# EAGLE schematic Poppy_IO_Core_v1.1 (EAGLE 7.3.0)
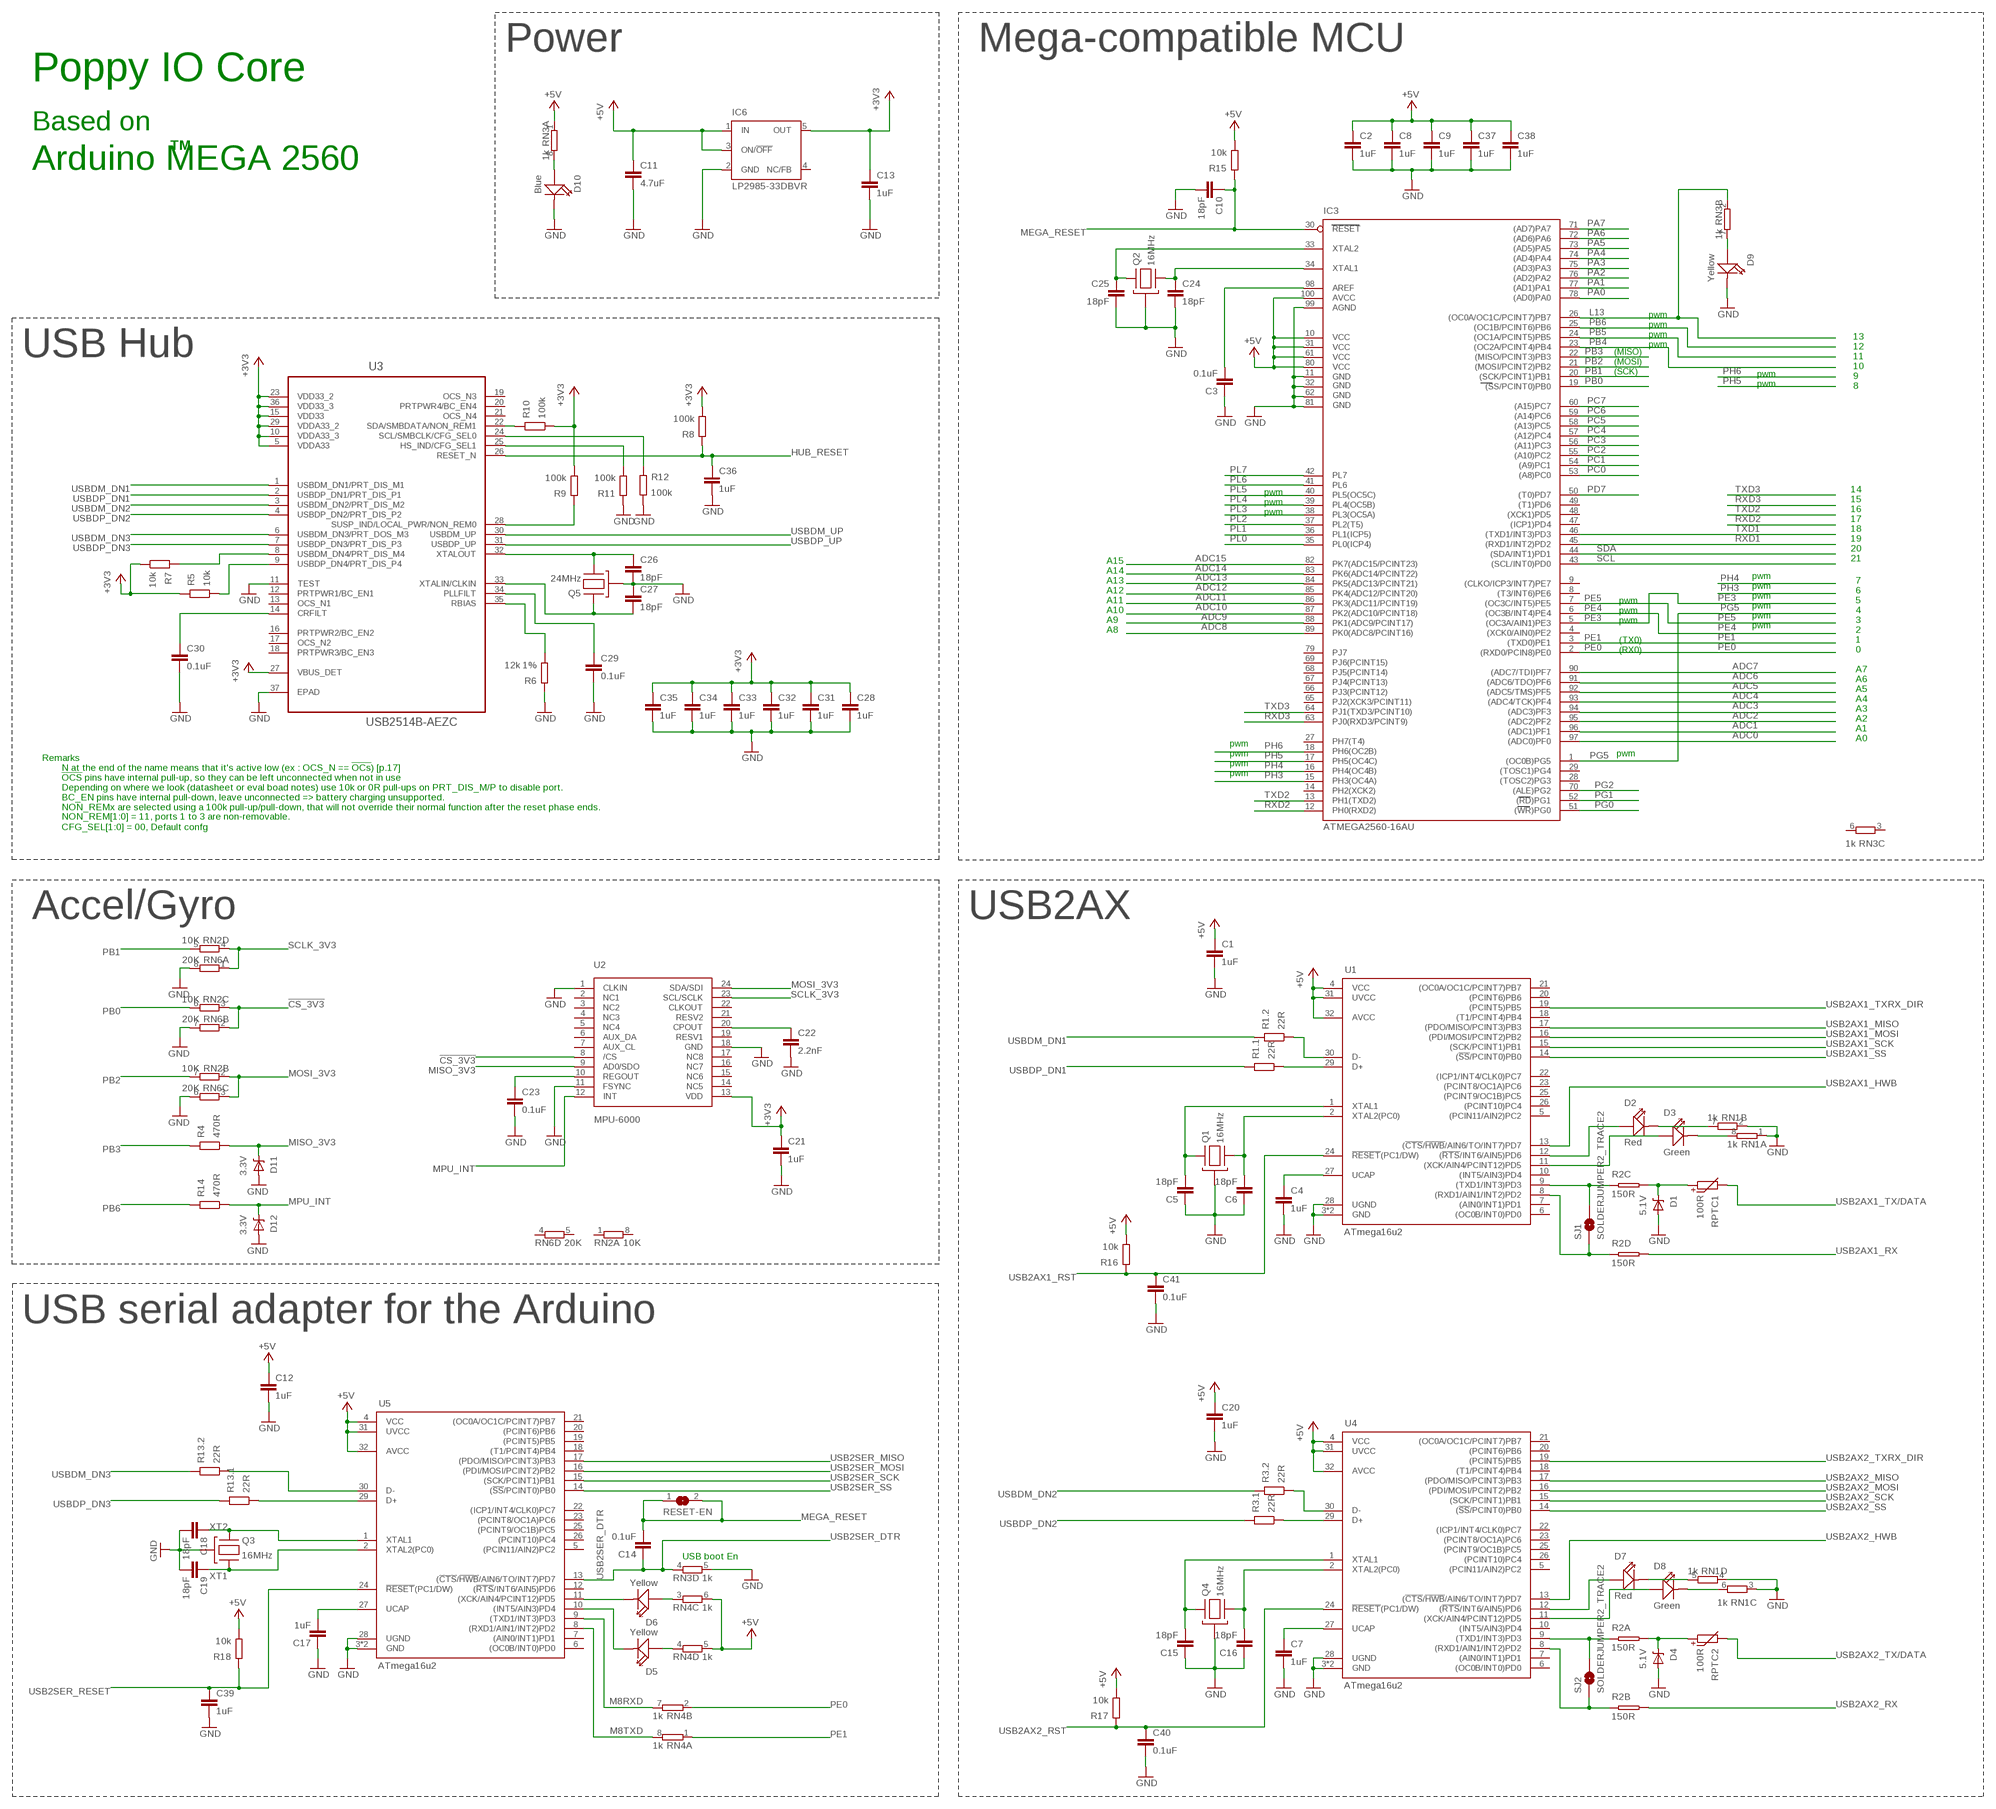
[diagram p0: schematic, sheet 1, part 1 of 2]
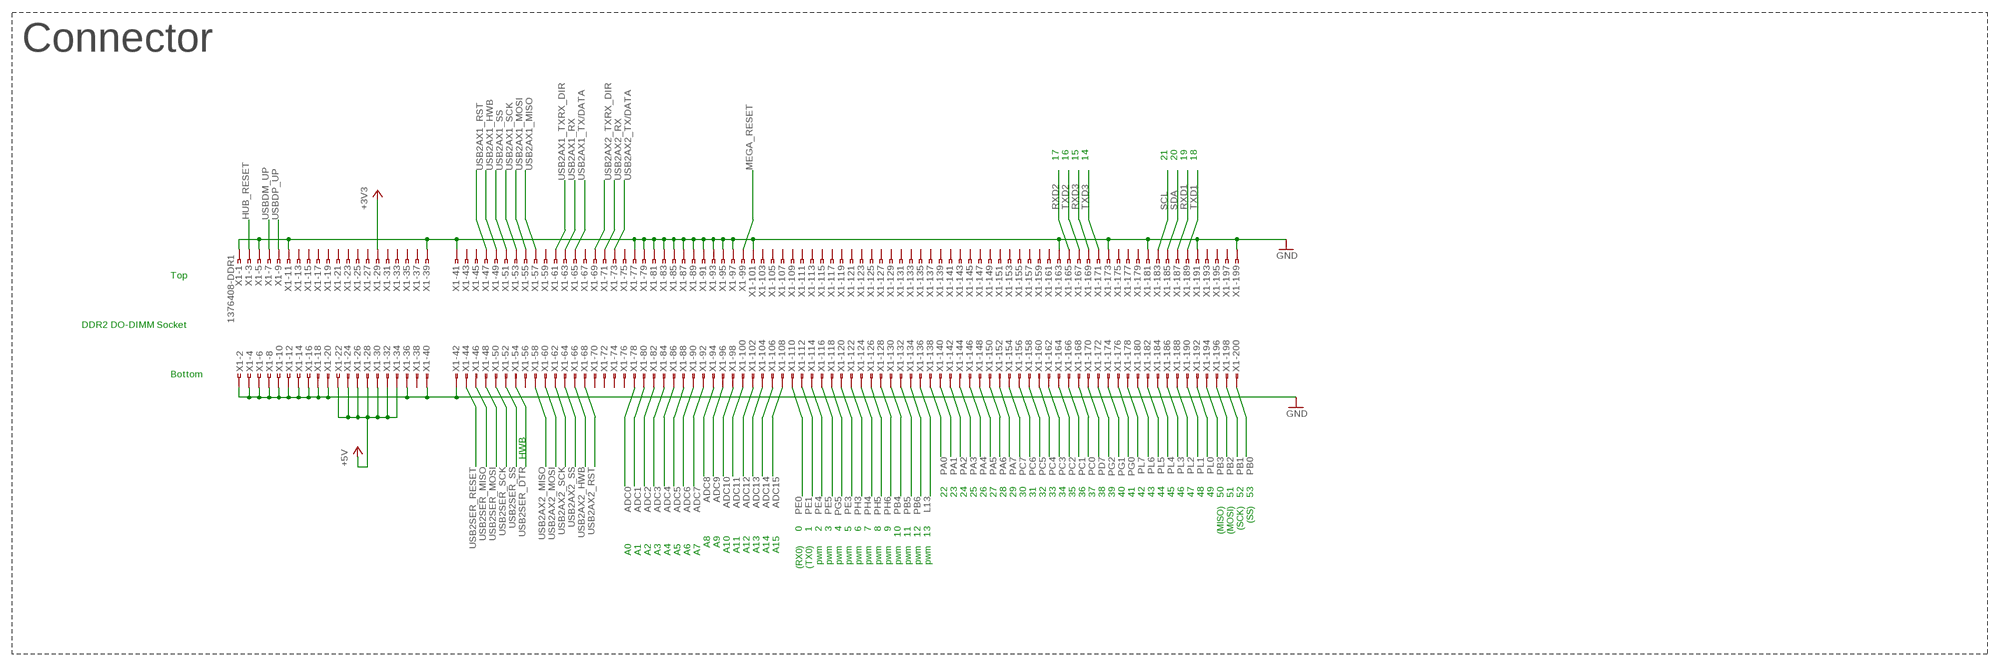
[diagram p1: schematic, sheet 1, part 2 of 2]

## Parts
C1  1uF  C0402  [0402_N]
C2  1uF  C0402  [0402_N]
C3  0.1uF  C0402  [0402_N]
C4  1uF  C0402  [0402_N]
C5  18pF  C0402  [0402_N]
C6  18pF  C0402  [0402_N]
C7  1uF  C0402  [0402_N]
C8  1uF  C0402  [0402_N]
C9  1uF  C0402  [0402_N]
C10  18pF  C0402  [0402_N]
C11  4.7uF  C0805  [0805_N]
C12  1uF  C0402  [0402_N]
C13  1uF  C0402  [0402_N]
C14  0.1uF  C0402  [0402_N]
C15  18pF  C0402  [0402_N]
C16  18pF  C0402  [0402_N]
C17  1uF  C0402  [0402_N]
C18  18pF  C0402  [0402_N]
C19  18pF  C0402  [0402_N]
C20  1uF  C0402  [0402_N]
C21  1uF  C0402  [0402_N]
C22  2.2nF  C0402  [0402_N]
C23  0.1uF  C0402  [0402_N]
C24  18pF  C0402  [0402_N]
C25  18pF  C0402  [0402_N]
C26  18pF  C0402  [0402_N]
C27  18pF  C0402  [0402_N]
C28  1uF  C0402  [0402_N]
C29  0.1uF  C0402  [0402_N]
C30  0.1uF  C0402  [0402_N]
C31  1uF  C0402  [0402_N]
C32  1uF  C0402  [0402_N]
C33  1uF  C0402  [0402_N]
C34  1uF  C0402  [0402_N]
C35  1uF  C0402  [0402_N]
C36  1uF  C0402  [0402_N]
C37  1uF  C0402  [0402_N]
C38  1uF  C0402  [0402_N]
C39  1uF  C0402  [0402_N]
C40  0.1uF  C0402  [0402_N]
C41  0.1uF  C0402  [0402_N]
D1  5.1V  DIODE_ZENER-923  [SOD-923_N]
D2  Red  LED  [LED0603]
D3  Green  LED  [LED0603]
D4  5.1V  DIODE_ZENER-923  [SOD-923_N]
D5  Yellow  LED  [LED0603]
D6  Yellow  LED  [LED0603]
D7  Red  LED  [LED0603]
D8  Green  LED  [LED0603]
D9  Yellow  LED  [LED0603]
D10  Blue  LED  [LED0603]
D11  3.3V  DIODE_ZENER-SOD523  [SOD-523_N]
D12  3.3V  DIODE_ZENER-SOD523  [SOD-523_N]
IC3  ATMEGA2560-16AU  ATMEGA25602560-16AU  [TQFP100]
IC6  LP2985-33DBVR  LP2985-XXDBVR33  [SOT23-DBV]
Q1  16MHz  CRYSTAL_W/BODY_403  [CRYSTAL_MODEL-403_N]
Q2  16MHz  CRYSTAL_W/BODY_403  [CRYSTAL_MODEL-403_N]
Q3  16MHz  CRYSTAL_W/BODY_403  [CRYSTAL_MODEL-403_N]
Q4  16MHz  CRYSTAL_W/BODY_403  [CRYSTAL_MODEL-403_N]
Q5  24MHz  CRYSTAL_W/BODY_403  [CRYSTAL_MODEL-403_N]
R1  22R  R_2-0402  [ARRAY_0402_65P_2_N]
R2  150R  R-4R  [R1206-8]
R3  22R  R_2-0402  [ARRAY_0402_65P_2_N]
R4  470R  R0402  [0402_N]
R5  10k  R0402  [0402_N]
R6  12k 1%  R0402  [0402_N]
R7  10k  R0402  [0402_N]
R8  100k  R0402  [0402_N]
R9  100k  R0402  [0402_N]
R10  100k  R0402  [0402_N]
R11  100k  R0402  [0402_N]
R12  100k  R0402  [0402_N]
R13  22R  R_2-0402  [ARRAY_0402_65P_2_N]
R14  470R  R0402  [0402_N]
R15  10k  R0402  [0402_N]
R16  10k  R0402  [0402_N]
R17  10k  R0402  [0402_N]
R18  10k  R0402  [0402_N]
RESET-EN  SJ  [SJ]
RN1  1k  4R-NCAY16  [CAY16]
RN2  10K  4R-NCAT16  [CAT16]
RN3  1k  4R-NCAY16  [CAY16]
RN4  1k  4R-NCAY16  [CAY16]
RN6  20K  4R-NCAT16  [CAT16]
RPTC1  100R  R-PTC0603  [0603_N]
RPTC2  100R  R-PTC0603  [0603_N]
SJ1  SOLDERJUMPER2_TRACE2  [SJ_2S-TRACE2]
SJ2  SOLDERJUMPER2_TRACE2  [SJ_2S-TRACE2]
U1  ATmega16u2  IC_ATMEGAXXU2-MU  [QFN-32_50P_N]
U2  MPU-6000  [QFN-24]
U3  USB2514B-AEZC  [QFN50P600X600X100-37N]
U4  ATmega16u2  IC_ATMEGAXXU2-MU  [QFN-32_50P_N]
U5  ATmega16u2  IC_ATMEGAXXU2-MU  [QFN-32_50P_N]
X1  1376408-DDR1  [DDR1]

## Nets
!CS_3V3: RN2.3 RN6.2 U2.8(/CS)
+3V3: C13.1 C21.1 C28.1 C31.1 C32.1 C33.1 C34.1 C35.1 IC6.5(OUT) R5.2 R7.1 R8.1 R9.1 R10.1 U2.13(VDD) U3.5(VDDA33) U3.10(VDDA33_3) U3.15(VDD33) U3.23(VDD33_2) U3.27(VBUS_DET) U3.29(VDDA33_2) U3.36(VDD33_3) X1.29
+5V: C1.1 C2.1 C8.1 C9.1 C11.1 C12.1 C20.1 C37.1 C38.1 IC3.10(VCC) IC3.31(VCC1) IC3.61(VCC2) IC3.80(VCC3) IC3.100(AVCC) IC6.1(IN) IC6.3(ON/!OFF) R15.1 R16.1 R17.1 R18.1 RN3.1 RN4.5 RN4.6 U1.4(VCC) U1.31(UVCC) U1.32(AVCC) U4.4(VCC) U4.31(UVCC) U4.32(AVCC) U5.4(VCC) U5.31(UVCC) U5.32(AVCC) X1.22 X1.24 X1.26 X1.28 X1.30 X1.32 X1.34
ADC0: IC3.97((ADC0)PF0) X1.78
ADC1: IC3.96((ADC1)PF1) X1.80
ADC2: IC3.95((ADC2)PF2) X1.82
ADC3: IC3.94((ADC3)PF3) X1.84
ADC4: IC3.93((ADC4/TCK)PF4) X1.86
ADC5: IC3.92((ADC5/TMS)PF5) X1.88
ADC6: IC3.91((ADC6/TDO)PF6) X1.90
ADC7: IC3.90((ADC7/TDI)PF7) X1.92
ADC8: IC3.89(PK0(ADC8/PCINT16)) X1.94
ADC9: IC3.88(PK1(ADC9/PCINT17)) X1.96
ADC10: IC3.87(PK2(ADC10/PCINT18)) X1.98
ADC11: IC3.86(PK3(ADC11/PCINT19)) X1.100
ADC12: IC3.85(PK4(ADC12/PCINT20)) X1.102
ADC13: IC3.84(PK5(ADC13/PCINT21)) X1.104
ADC14: IC3.83(PK6(ADC14/PCINT22)) X1.106
ADC15: IC3.82(PK7(ADC15/PCINT23)) X1.108
AREF: C3.2 IC3.98(AREF)
GND: C1.2 C2.2 C3.1 C4.2 C5.1 C6.1 C7.2 C8.2 C9.2 C10.2 C11.2 C12.2 C13.2 C15.1 C16.1 C17.1 C18.2 C19.2 C20.2 C21.2 C22.2 C23.2 C24.2 C25.2 C26.2 C27.1 C28.2 C29.2 C30.2 C31.2 C32.2 C33.2 C34.2 C35.2 C36.2 C37.2 C38.2 C39.2 C40.2 C41.2 D1.A D4.A D9.- D10.- D11.A D12.A IC3.11(GND) IC3.32(GND1) IC3.62(GND2) IC3.81(GND3) IC3.99(AGND) IC6.2(GND) Q1.P$2(GND) Q1.P$4(GND) Q2.P$2(GND) Q2.P$4(GND) Q3.P$2(GND) Q3.P$4(GND) Q4.P$2(GND) Q4.P$4(GND) Q5.P$2(GND) Q5.P$4(GND) R6.2 R11.2 R12.1 RN1.1 RN1.2 RN1.3 RN1.4 RN3.5 RN6.6 RN6.7 RN6.8 U1.3(GND) U1.28(UGND) U1.33(GND) U2.1(CLKIN) U2.11(FSYNC) U2.18(GND) U3.11(TEST) U3.37(EPAD) U4.3(GND) U4.28(UGND) U4.33(GND) U5.3(GND) U5.28(UGND) U5.33(GND) X1.1 X1.2 X1.4 X1.5 X1.6 X1.8 X1.10 X1.11 X1.12 X1.14 X1.16 X1.18 X1.20 X1.36 X1.39 X1.40 X1.41 X1.42 X1.77 X1.79 X1.81 X1.83 X1.85 X1.87 X1.89 X1.91 X1.93 X1.95 X1.97 X1.101 X1.163 X1.173 X1.181 X1.191 X1.199
HUB_RESET: C36.1 R8.2 U3.26(RESET_N) X1.3
L13: IC3.26((OC0A/OC1C/PCINT7)PB7) RN3.2 X1.136
M8RXD: RN4.7 U5.9((TXD1/INT3)PD3)
M8TXD: RN4.8 U5.8((RXD1/AIN1/INT2)PD2)
MEGA_RESET: C10.1 C14.2 IC3.30(RESET) R15.2 RESET-EN.1 RESET-EN.2 X1.99
MISO_3V3: D11.C R4.1 U2.9(AD0/SDO)
MOSI_3V3: RN2.2 RN6.3 U2.24(SDA/SDI)
MPU_INT: D12.C R14.1 U2.12(INT)
N$1: D8.- RN1.6
N$2: R2.4 SJ1.1 U1.8((RXD1/AIN1/INT2)PD2)
N$3: C4.1 U1.27(UCAP)
N$4: D1.C R2.6 RPTC1.1
N$5: D3.+ U1.11((XCK/AIN4/PCINT12)PD5)
N$6: D10.+ RN3.8
N$7: C6.2 Q1.P$3 U1.2(XTAL2(PC0))
N$8: C5.2 Q1.P$1 U1.1(XTAL1)
N$9: R1.1 U1.30(D-)
N$10: R1.2 U1.29(D+)
N$11: D7.- RN1.5
N$12: D2.- RN1.7
N$13: D3.- RN1.8
N$14: R2.1 SJ2.2 U4.9((TXD1/INT3)PD3)
N$15: D2.+ U1.12((!RTS!/INT6/AIN5)PD6)
N$16: D9.+ RN3.7
N$17: C7.1 U4.27(UCAP)
N$18: C16.2 Q4.P$3 U4.2(XTAL2(PC0))
N$19: C15.2 Q4.P$1 U4.1(XTAL1)
N$20: R2.3 SJ1.2 U1.9((TXD1/INT3)PD3)
N$21: R2.2 SJ2.1 U4.8((RXD1/AIN1/INT2)PD2)
N$22: D4.C R2.8 RPTC2.1
N$23: R3.1 U4.30(D-)
N$24: R3.2 U4.29(D+)
N$27: D8.+ U4.11((XCK/AIN4/PCINT12)PD5)
N$28: D7.+ U4.12((!RTS!/INT6/AIN5)PD6)
N$31: C23.1 U2.10(REGOUT)
N$32: C26.1 Q5.P$3 U3.32(XTALOUT)
N$33: C22.1 U2.20(CPOUT)
N$34: R7.2 U3.8(USBDM_DN4/PRT_DIS_M4)
N$35: C27.2 Q5.P$1 U3.33(XTALIN/CLKIN)
N$36: R5.1 U3.9(USBDP_DN4/PRT_DIS_P4)
N$38: C30.1 U3.14(CRFILT)
N$39: R9.2 U3.28(SUSP_IND/LOCAL_PWR/NON_REM0)
N$40: C29.1 U3.34(PLLFILT)
N$41: R6.1 U3.35(RBIAS)
N$42: R10.2 U3.22(SDA/SMBDATA/NON_REM1)
N$43: R12.2 U3.24(SCL/SMBCLK/CFG_SEL0)
N$44: R11.1 U3.25(HS_IND/CFG_SEL1)
N$54: D5.+ RN4.4
N$55: D6.+ RN4.3
PA0: IC3.78((AD0)PA0) X1.138
PA1: IC3.77((AD1)PA1) X1.140
PA2: IC3.76((AD2)PA2) X1.142
PA3: IC3.75((AD3)PA3) X1.144
PA4: IC3.74((AD4)PA4) X1.146
PA5: IC3.73((AD5)PA5) X1.148
PA6: IC3.72((AD6)PA6) X1.150
PA7: IC3.71((AD7)PA7) X1.152
PB0: IC3.19((SS/PCINT0)PB0) RN2.6 X1.200
PB1: IC3.20((SCK/PCINT1)PB1) RN2.5 X1.198
PB2: IC3.21((MOSI/PCINT2)PB2) RN2.7 X1.196
PB3: IC3.22((MISO/PCINT3)PB3) R4.2 X1.194
PB4: IC3.23((OC2A/PCINT4)PB4) X1.130
PB5: IC3.24((OC1A/PCINT5)PB5) X1.132
PB6: IC3.25((OC1B/PCINT6)PB6) R14.2 X1.134
PC0: IC3.53((A8)PC0) X1.168
PC1: IC3.54((A9)PC1) X1.166
PC2: IC3.55((A10)PC2) X1.164
PC3: IC3.56((A11)PC3) X1.162
PC4: IC3.57((A12)PC4) X1.160
PC5: IC3.58((A13)PC5) X1.158
PC6: IC3.59((A14)PC6) X1.156
PC7: IC3.60((A15)PC7) X1.154
PD7: IC3.50((T0)PD7) X1.170
PE0: IC3.2((RXD0/PCIN8)PE0) RN4.2 X1.110
PE1: IC3.3((TXD0)PE1) RN4.1 X1.112
PE3: IC3.5((OC3A/AIN1)PE3) X1.120
PE4: IC3.6((OC3B/INT4)PE4) X1.114
PE5: IC3.7((OC3C/INT5)PE5) X1.116
PG0: IC3.51((WR)PG0) X1.176
PG1: IC3.52((RD)PG1) X1.174
PG2: IC3.70((ALE)PG2) X1.172
PG5: IC3.1((OC0B)PG5) X1.118
PH3: IC3.15(PH3(OC4A)) X1.122
PH4: IC3.16(PH4(OC4B)) X1.124
PH5: IC3.17(PH5(OC4C)) X1.126
PH6: IC3.18(PH6(OC2B)) X1.128
PL0: IC3.35(PL0(ICP4)) X1.192
PL1: IC3.36(PL1(ICP5)) X1.190
PL2: IC3.37(PL2(T5)) X1.188
PL3: IC3.38(PL3(OC5A)) X1.186
PL4: IC3.39(PL4(OC5B)) X1.184
PL5: IC3.40(PL5(OC5C)) X1.182
PL6: IC3.41(PL6) X1.180
PL7: IC3.42(PL7) X1.178
RD+: R13.2 U5.29(D+)
RD-: R13.1 U5.30(D-)
RXD1: IC3.45((RXD1/INT2)PD2) X1.187
RXD2: IC3.12(PH0(RXD2)) X1.165
RXD3: IC3.63(PJ0(RXD3/PCINT9)) X1.169
RXL: D5.- U5.10((INT5/AIN3)PD4)
SCL: IC3.43((SCL/INT0)PD0) X1.183
SCLK_3V3: RN2.4 RN6.1 U2.23(SCL/SCLK)
SDA: IC3.44((SDA/INT1)PD1) X1.185
TXD1: IC3.46((TXD1/INT3)PD3) X1.189
TXD2: IC3.13(PH1(TXD2)) X1.167
TXD3: IC3.64(PJ1(TXD3/PCINT10)) X1.171
TXL: D6.- U5.11((XCK/AIN4/PCINT12)PD5)
USB2AX1_HWB: U1.13((!CTS!/!HWB!/AIN6/TO/INT7)PD7) X1.49
USB2AX1_MISO: U1.17((PDO/MISO/PCINT3)PB3) X1.57
USB2AX1_MOSI: U1.16((PDI/MOSI/PCINT2)PB2) X1.55
USB2AX1_RST: C41.1 R16.2 U1.24(!RESET!(PC1/DW)) X1.47
USB2AX1_RX: R2.5 X1.63
USB2AX1_SCK: U1.15((SCK/PCINT1)PB1) X1.53
USB2AX1_SS: U1.14((!SS!/PCINT0)PB0) X1.51
USB2AX1_TX/DATA: RPTC1.2 X1.65
USB2AX1_TXRX_DIR: U1.19((PCINT5)PB5) X1.61
USB2AX2_HWB: U4.13((!CTS!/!HWB!/AIN6/TO/INT7)PD7) X1.66
USB2AX2_MISO: U4.17((PDO/MISO/PCINT3)PB3) X1.58
USB2AX2_MOSI: U4.16((PDI/MOSI/PCINT2)PB2) X1.60
USB2AX2_RST: C40.1 R17.2 U4.24(!RESET!(PC1/DW)) X1.68
USB2AX2_RX: R2.7 X1.71
USB2AX2_SCK: U4.15((SCK/PCINT1)PB1) X1.62
USB2AX2_SS: U4.14((!SS!/PCINT0)PB0) X1.64
USB2AX2_TX/DATA: RPTC2.2 X1.73
USB2AX2_TXRX_DIR: U4.19((PCINT5)PB5) X1.69
USB2SER_DTR: C14.1 RN3.4 U5.13((!CTS!/!HWB!/AIN6/TO/INT7)PD7) X1.54
USB2SER_MISO: U5.17((PDO/MISO/PCINT3)PB3) X1.46
USB2SER_MOSI: U5.16((PDI/MOSI/PCINT2)PB2) X1.48
USB2SER_RESET: C39.1 R18.2 U5.24(!RESET!(PC1/DW)) X1.44
USB2SER_SCK: U5.15((SCK/PCINT1)PB1) X1.50
USB2SER_SS: U5.14((!SS!/PCINT0)PB0) X1.52
USBDM_DN1: R1.4 U3.1(USBDM_DN1/PRT_DIS_M1)
USBDM_DN2: R3.4 U3.3(USBDM_DN2/PRT_DIS_M2)
USBDM_DN3: R13.4 U3.6(USBDM_DN3/PRT_DOS_M3)
USBDM_UP: U3.30(USBDM_UP) X1.7
USBDP_DN1: R1.3 U3.2(USBDP_DN1/PRT_DIS_P1)
USBDP_DN2: R3.3 U3.4(USBDP_DN2/PRT_DIS_P2)
USBDP_DN3: R13.3 U3.7(USBDP_DN3/PRT_DIS_P3)
USBDP_UP: U3.31(USBDP_UP) X1.9
VUCAP: C17.2 U5.27(UCAP)
XT1: C19.1 Q3.P$3 U5.2(XTAL2(PC0))
XT2: C18.1 Q3.P$1 U5.1(XTAL1)
XTAL1: C24.1 IC3.34(XTAL1) Q2.P$3
XTAL2: C25.1 IC3.33(XTAL2) Q2.P$1
Unconnected: IC3.4((XCK0/AIN0)PE2) IC3.8((T3/INT6)PE6) IC3.9((CLKO/ICP3/INT7)PE7) IC3.14(PH2(XCK2)) IC3.27(PH7(T4)) IC3.28((TOSC2)PG3) IC3.29((TOSC1)PG4) IC3.47((ICP1)PD4) IC3.48((XCK1)PD5) IC3.49((T1)PD6) IC3.65(PJ2(XCK3/PCINT11)) IC3.66(PJ3(PCINT12)) IC3.67(PJ4(PCINT13)) IC3.68(PJ5(PCINT14)) IC3.69(PJ6(PCINT15)) IC3.79(PJ7) IC6.4(NC/FB) RN2.1 RN2.8 RN3.3 RN3.6 RN6.4 RN6.5 U1.5((PCIN11/AIN2)PC2) U1.6((OC0B/INT0)PD0) U1.7((AIN0/INT1)PD1) U1.10((INT5/AIN3)PD4) U1.18((T1/PCINT4)PB4) U1.20((PCINT6)PB6) U1.21((OC0A/OC1C/PCINT7)PB7) U1.22((ICP1/INT4/CLK0)PC7) U1.23((PCINT8/OC1A)PC6) U1.25((PCINT9/OC1B)PC5) U1.26((PCINT10)PC4) U2.2(NC1) U2.3(NC2) U2.4(NC3) U2.5(NC4) U2.6(AUX_DA) U2.7(AUX_CL) U2.14(NC5) U2.15(NC6) U2.16(NC7) U2.17(NC8) U2.19(RESV1) U2.21(RESV2) U2.22(CLKOUT) U3.12(PRTPWR1/BC_EN1) U3.13(OCS_N1) U3.16(PRTPWR2/BC_EN2) U3.17(OCS_N2) U3.18(PRTPWR3/BC_EN3) U3.19(OCS_N3) U3.20(PRTPWR4/BC_EN4) U3.21(OCS_N4) U4.5((PCIN11/AIN2)PC2) U4.6((OC0B/INT0)PD0) U4.7((AIN0/INT1)PD1) U4.10((INT5/AIN3)PD4) U4.18((T1/PCINT4)PB4) U4.20((PCINT6)PB6) U4.21((OC0A/OC1C/PCINT7)PB7) U4.22((ICP1/INT4/CLK0)PC7) U4.23((PCINT8/OC1A)PC6) U4.25((PCINT9/OC1B)PC5) U4.26((PCINT10)PC4) U5.5((PCIN11/AIN2)PC2) U5.6((OC0B/INT0)PD0) U5.7((AIN0/INT1)PD1) U5.12((!RTS!/INT6/AIN5)PD6) U5.18((T1/PCINT4)PB4) U5.19((PCINT5)PB5) U5.20((PCINT6)PB6) U5.21((OC0A/OC1C/PCINT7)PB7) U5.22((ICP1/INT4/CLK0)PC7) U5.23((PCINT8/OC1A)PC6) U5.25((PCINT9/OC1B)PC5) U5.26((PCINT10)PC4) X1.13 X1.15 X1.17 X1.19 X1.21 X1.23 X1.25 X1.27 X1.31 X1.33 X1.35 X1.37 X1.38 X1.43 X1.45 X1.56 X1.59 X1.67 X1.70 X1.72 X1.74 X1.75 X1.76 X1.103 X1.105 X1.107 X1.109 X1.111 X1.113 X1.115 X1.117 X1.119 X1.121 X1.123 X1.125 X1.127 X1.129 X1.131 X1.133 X1.135 X1.137 X1.139 X1.141 X1.143 X1.145 X1.147 X1.149 X1.151 X1.153 X1.155 X1.157 X1.159 X1.161 X1.175 X1.177 X1.179 X1.193 X1.195 X1.197

## Notes on the sheet
- Power | Mega-compatible MCU
- Poppy IO Core
- Based on
- TM
- Arduino MEGA 2560
- pwm
- pwm
- pwm | 13
- pwm | 12
- USB Hub | (MISO)
- 11
- (MOSI)
- 10
- (SCK) | pwm
- 9
- pwm | 8
- pwm | 14
- pwm | 15
- pwm | 16
- 17
- 18
- 19
- 20
- A15 | 21
- A14
- pwm
- A13 | 7
- pwm
- A12 | 6
- pwm
- A11 | pwm | 5
- pwm
- A10 | pwm | 4
- pwm
- A9 | pwm | 3
- pwm
- A8 | 2
- (TX0) | 1
- (RX0) | 0
- A7
- A6
- A5
- A4
- A3
- A2
- A1
- A0
- pwm
- pwm | pwm
- Remarks
- pwm
- N at the end of the name means that it's active low (ex : OCS_N == !OCs!) [p.17]
- pwm
- !OCS! pins have internal pull-up, so they can be left unconnected when not in use
- Depending on where we look (datasheet or eval boad notes) use 10k or 0R pull-ups on PRT_DIS_M/P to disable port.
- BC_EN pins have internal pull-down, leave unconnected => battery charging unsupported.
- NON_REMx are selected using a 100k pull-up/pull-down, that will not override their normal function after the reset phase ends.
- NON_REM[1:0] = 11, ports 1 to 3 are non-removable.
  CFG_SEL[1:0] = 00, Default confg
- Accel/Gyro | USB2AX
- USB serial adapter for the Arduino
- USB boot En
- Connector
- 17 | 16 | 15 | 14 | 21 | 20 | 19 | 18
- Top
- DDR2 DO-DIMM Socket
- Bottom
- HWB
- 22 | 23 | 24 | 25 | 26 | 27 | 28 | 29 | 30 | 31 | 32 | 33 | 34 | 35 | 36 | 37 | 38 | 39 | 40 | 41 | 42 | 43 | 44 | 45 | 46 | 47 | 48 | 49 | 50 | 51 | 52 | 53
- (MISO) | (MOSI) | (SCK) | (SS)
- 0 | 1 | 2 | 3 | 4 | 5 | 6 | 7 | 8 | 9 | 10 | 11 | 12 | 13
- A8 | A9 | A10 | A11 | A12 | A13 | A14 | A15
- (RX0) | (TX0) | pwm | pwm | pwm | pwm | pwm | pwm | pwm | pwm | pwm | pwm | pwm | pwm
- A0 | A1 | A2 | A3 | A4 | A5 | A6 | A7

## Library data of the parts
C1-C41 = Xevelabs:C: Non-polarized Capacitor
D1 D4 D11 D12 = Xevelabs:DIODE_ZENER: Zener Diode
D2 D3 D5-D10 = OPL:LED*: LED
IC3 = SmartPrj:ATMEGA2560: MICROCONTROLLER 64/128/256 Kbytes FLASH 4 Kbytes EEPROM 8 Kbytes SRAM 86 General Purpose I/O pins 12-channels16-bit PWM 4 x Serial USARTs 16-channels 10-bit A/D
IC6 = SmartPrj:LP2985-XXDBVR: ULTRALOW-POWER 50-mA LOW-DROPOUT LINEAR REGULATORS 50-mA Low-Dropout Regulator Source: http://focus.ti.com/lit/ds/symlink/tps77001.pdf
Q1-Q5 = Xevelabs:CRYSTAL_W/BODY: Crystal oscillator, with connection to the body.
R1 R3 R13 = Xevelabs:R_2: Resistor Array of 2.
R2 = OPL:R-4R*: Resistor Array
R4-R12 R14-R18 = Xevelabs:R: Resistor
RESET-EN = jumper:SJ: SMD solder JUMPER
RN1-RN4 RN6 = resistor-dil:4R-N: Array Chip Resistor Source: RS Component / Phycomp; OC_FARNELL: unknown; OC_NEWARK: unknown
RPTC1 RPTC2 = Xevelabs:R-PTC: PTC (Positive Temperature Coefficient) Resistor
SJ1 SJ2 = Xevelabs:SOLDERJUMPER2: Solder Jumper Standard SMD solder jumper. Used to automate production. Two varients : Normally Open and Normally Closed are the same, but have different paste layers. NC will have a large amount of paste and should jumper during reflow.
U1 U4 U5 = Xevelabs:IC_ATMEGAXXU2
U2 = 3DRobotics_Master_Library:MPU-6000: Invensense MPU-6000: 3-axis gyro, 3-axis accel & 9-axis MotionFusion The MPU-60X0 Motion Processing Unit (MPU?) is the world?s first motion processing solution with integrated 9-axis sensor fusion for handset and tablet applications, game controllers, motion pointer remote controls, and other consumer devices. The MPU-60X0 has an embedded 3-axis MEMS gyroscope, 3-axis MEMS accelerometer and Digital Motion Processor? (DMP) hardware accelerator engine with an auxiliary I 2 C port that interfaces to third party digital sensors, such as magnetometers. Interfacing with a 3-axis magnetometer delivers a complete 9-axis sensor fusion output to the MPU?s primary I 2 C or SPI port. (SPI is available on MPU-6000 only). This combines acceleration and rotational motion plus heading information into a single data stream for the application; DATASHEET: http://invensense.com/mems/gyro/documents/PS-MPU-6000A-00_v1.0.pdf; LINK: http://invensense.com/mems/gyro/mpu6000.html; MFGPN: MPU-6000
U3 = Poppy_IO_Core_lib:USB2514B-AEZC: IC, 4-PORT USB 2.0 HUB CONTRL, 36VQFN; MPN: USB2514B-AEZC; OC_FARNELL: 2292604; OC_NEWARK: 66W2137; PACKAGE: 36VQFN; SUPPLIER: Microchip
X1 = Poppy_IO_Core_lib:1376408: DDR1 & DDR2 SODIMM SOCKET 0.6mm Pitch 200 Pos. Standard Profile, Standard Type (used on Kontron X-Board) Source: http://catalog.tycoelectronics.com .. JPN_CD_1376408_S.pdf

## Net classes
1 power: width 0.61 mm, drill 0.406 mm, clearance 0.203 mm
2 gnd: width 0.305 mm, drill 0.406 mm, clearance 0.203 mm
3 power usb: width 0.508 mm, drill 0.406 mm, clearance 0.203 mm